# Altium schematic sheet NAND flash.SchDoc
size A4; SheetNumber: 5; SheetTotal: 9
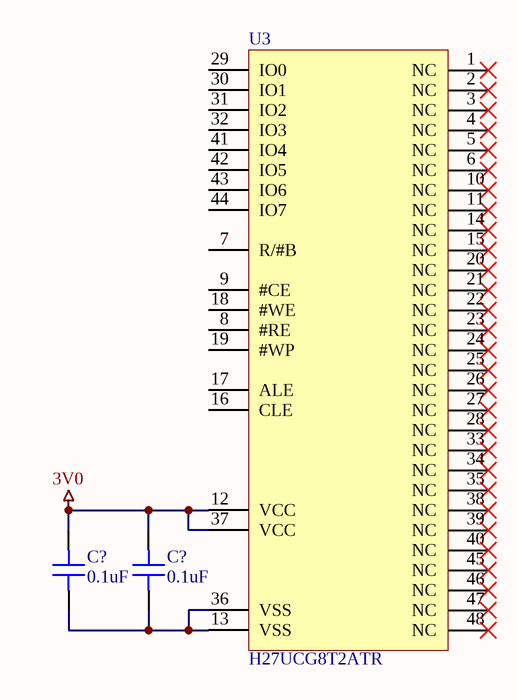
[diagram p0: NAND flash.SchDoc]

## Parts
(Parts that share a designator on the sheet are numbered #1, #2 ... from top to bottom, then left to right.)
C?#1  0.1uF  [CAPC1005X06N]
C?#2  0.1uF  [CAPC1005X06N]
U3  H27UCG8T2ATR  [TSSOP50P2000X120-48N]

## Nets
3V0: C?#1.1 C?#2.1 U3.12(VCC) U3.37(VCC)
NetC?#1_2: C?#1.2 C?#2.2 U3.13(VSS) U3.36(VSS)

Not connected (* = marked no-connect by the designer): U3 1(NC)* 2(NC)* 3(NC)* 4(NC)* 5(NC)* 6(NC)* 7(R/#B) 8(#RE) 9(#CE) 10(NC)* 11(NC)* 14(NC)* 15(NC)* 16(CLE) 17(ALE) 18(#WE) 19(#WP) 20(NC)* 21(NC)* 22(NC)* 23(NC)* 24(NC)* 25(NC)* 26(NC)* 27(NC)* 28(NC)* 29(IO0) 30(IO1) 31(IO2) 32(IO3) 33(NC)* 34(NC)* 35(NC)* 38(NC)* 39(NC)* 40(NC)* 41(IO4) 42(IO5) 43(IO6) 44(IO7) 45(NC)* 46(NC)* 47(NC)* 48(NC)*

## Library data of the parts
C?#1 C?#2 = 0402B104K500CT: Manufacturer: Walsin Tech Corp; Voltage: 50V; Tolerance: 10%; Dielectric: X7R; Min Temperature: -55; Max Temperature: 125; Part Number: 0402B104K500CT; ComponentLink1URL: https://datasheet.lcsc.com/lcsc/1810191621_Walsin-Tech-Corp-0402B104K500CT_C152814.pdf; ComponentLink1Description: Datasheet; Package: 0402; Part Status: Active; Capacitance: 0.1uF
U3 = H27UCG8T2ATR: NAND Flash Memory; MANUFACTURER: SK Hynix; Part Number: H27UCG8T2ATR; COMPONENTLINK1URL: https://z3d9b7u8.stackpathcdn.com/pdf-down/H/2/7/H27UCG8T2ATR-BC-Hynix.pdf; COMPONENTLINK1DESCRIPTION: Datasheet; PACKAGE: TSSOP-48; Part Status: Active